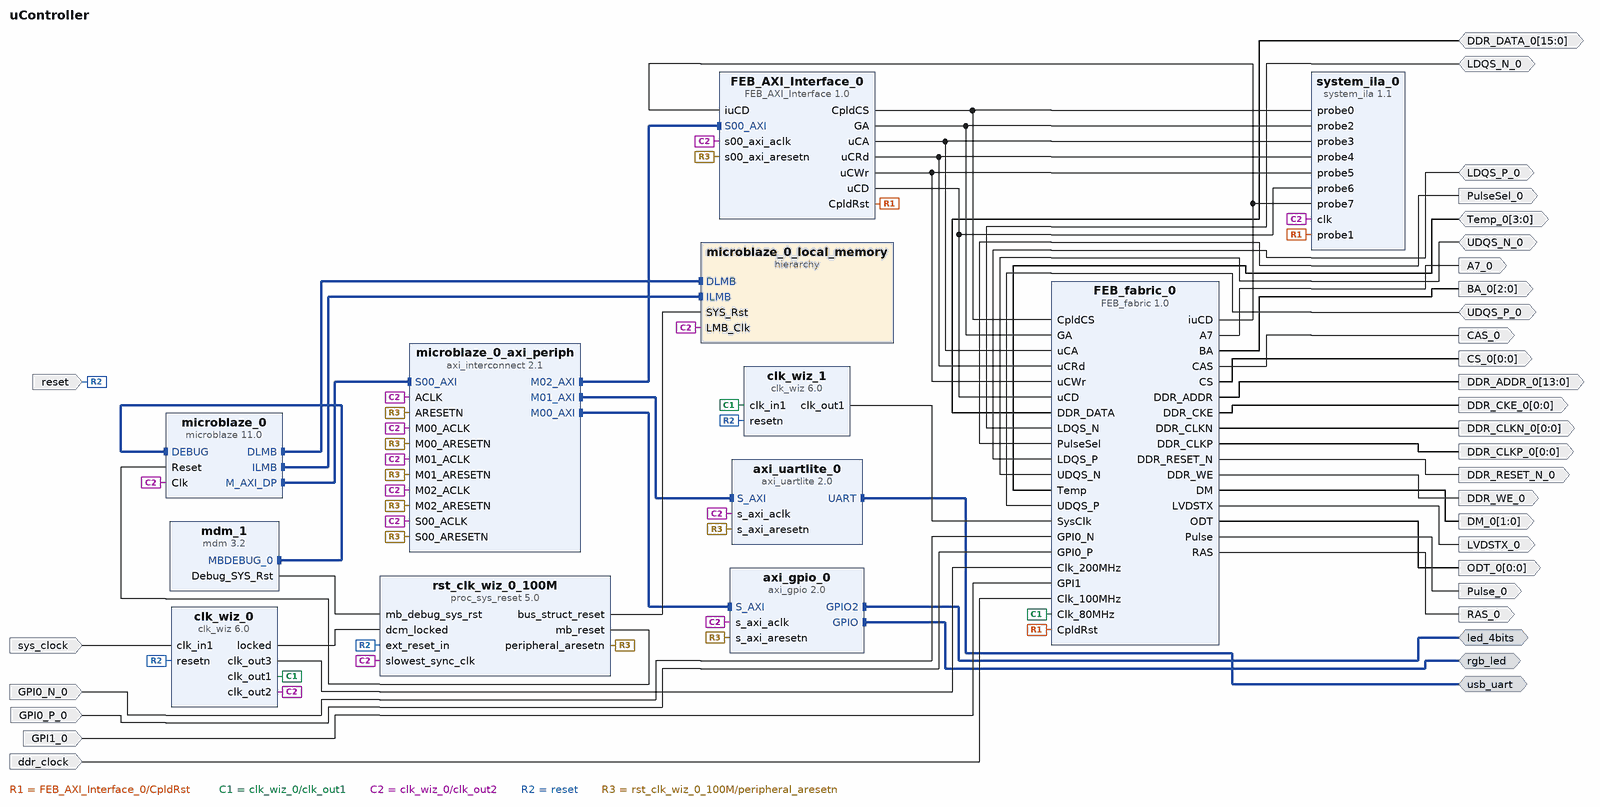
[diagram p0: block diagram of the top level]
# Vivado block design uController, xc7s50csga324-1, Vivado 2022.2
create_bd_design uController

create_bd_intf_port -mode Master -vlnv xilinx.com:interface:gpio_rtl:1.0 rgb_led
create_bd_intf_port -mode Master -vlnv xilinx.com:interface:gpio_rtl:1.0 led_4bits
create_bd_intf_port -mode Master -vlnv xilinx.com:interface:uart_rtl:1.0 usb_uart
create_bd_port -dir I -type clk sys_clock
set_property -dict {CONFIG.FREQ_HZ 12000000 CONFIG.PHASE 0.0} [get_bd_ports sys_clock]
create_bd_port -dir I -type rst reset
set_property -dict {CONFIG.POLARITY ACTIVE_LOW} [get_bd_ports reset]
create_bd_port -dir O -from 2 -to 0 BA_0
create_bd_port -dir O CAS_0
create_bd_port -dir O -from 0 -to 0 CS_0
create_bd_port -dir O -from 13 -to 0 DDR_ADDR_0
create_bd_port -dir O -from 0 -to 0 DDR_CKE_0
create_bd_port -dir O -from 0 -to 0 DDR_CLKN_0
create_bd_port -dir O -from 0 -to 0 DDR_CLKP_0
create_bd_port -dir IO -from 15 -to 0 DDR_DATA_0
create_bd_port -dir O DDR_RESET_N_0
create_bd_port -dir O DDR_WE_0
create_bd_port -dir O -from 1 -to 0 DM_0
create_bd_port -dir IO LDQS_N_0
create_bd_port -dir IO LDQS_P_0
create_bd_port -dir O -from 0 -to 0 ODT_0
create_bd_port -dir O RAS_0
create_bd_port -dir IO UDQS_N_0
create_bd_port -dir IO UDQS_P_0
create_bd_port -dir I -type clk ddr_clock
set_property -dict {CONFIG.FREQ_HZ 100000000 CONFIG.PHASE 0.0} [get_bd_ports ddr_clock]
create_bd_port -dir O PulseSel_0
create_bd_port -dir O Pulse_0
create_bd_port -dir I GPI1_0
create_bd_port -dir I GPI0_P_0
create_bd_port -dir I GPI0_N_0
create_bd_port -dir O A7_0
create_bd_port -dir O LVDSTX_0
create_bd_port -dir IO -from 3 -to 0 Temp_0

create_bd_cell -type ip -vlnv xilinx.com:ip:microblaze:11.0 microblaze_0
set_property -dict [list \
  CONFIG.C_DEBUG_ENABLED 1 \
  CONFIG.C_D_AXI 1 \
  CONFIG.C_D_LMB 1 \
  CONFIG.C_I_LMB 1 \
  CONFIG.G_TEMPLATE_LIST 8 \
] [get_bd_cells microblaze_0]
create_bd_cell -type ip -vlnv xilinx.com:ip:clk_wiz:6.0 clk_wiz_0
set_property -dict [list \
  CONFIG.CLKOUT1_JITTER 588.050 \
  CONFIG.CLKOUT1_PHASE_ERROR 613.025 \
  CONFIG.CLKOUT1_REQUESTED_OUT_FREQ 80.000 \
  CONFIG.CLKOUT2_JITTER 571.161 \
  CONFIG.CLKOUT2_PHASE_ERROR 613.025 \
  CONFIG.CLKOUT2_REQUESTED_OUT_FREQ 100.000 \
  CONFIG.CLKOUT2_USED true \
  CONFIG.CLKOUT3_JITTER 522.440 \
  CONFIG.CLKOUT3_PHASE_ERROR 613.025 \
  CONFIG.CLKOUT3_REQUESTED_OUT_FREQ 200.000 \
  CONFIG.CLKOUT3_USED true \
  CONFIG.CLKOUT4_JITTER 571.161 \
  CONFIG.CLKOUT4_PHASE_ERROR 613.025 \
  CONFIG.CLKOUT4_REQUESTED_OUT_FREQ 100.000 \
  CONFIG.CLKOUT4_USED false \
  CONFIG.CLK_IN1_BOARD_INTERFACE sys_clock \
  CONFIG.CLK_IN2_BOARD_INTERFACE Custom \
  CONFIG.MMCM_CLKFBOUT_MULT_F 50.000 \
  CONFIG.MMCM_CLKIN2_PERIOD 10.000 \
  CONFIG.MMCM_CLKOUT0_DIVIDE_F 7.500 \
  CONFIG.MMCM_CLKOUT1_DIVIDE 6 \
  CONFIG.MMCM_CLKOUT2_DIVIDE 3 \
  CONFIG.MMCM_CLKOUT3_DIVIDE 1 \
  CONFIG.NUM_OUT_CLKS 3 \
  CONFIG.RESET_BOARD_INTERFACE reset \
  CONFIG.RESET_PORT resetn \
  CONFIG.RESET_TYPE ACTIVE_LOW \
  CONFIG.SECONDARY_SOURCE Single_ended_clock_capable_pin \
  CONFIG.USE_BOARD_FLOW true \
  CONFIG.USE_INCLK_SWITCHOVER false \
] [get_bd_cells clk_wiz_0]
create_bd_cell -type ip -vlnv xilinx.com:ip:axi_gpio:2.0 axi_gpio_0
set_property -dict [list \
  CONFIG.GPIO2_BOARD_INTERFACE led_4bits \
  CONFIG.GPIO_BOARD_INTERFACE rgb_led \
  CONFIG.USE_BOARD_FLOW true \
] [get_bd_cells axi_gpio_0]
create_bd_cell -type ip -vlnv xilinx.com:ip:axi_uartlite:2.0 axi_uartlite_0
set_property -dict [list \
  CONFIG.C_BAUDRATE 230400 \
  CONFIG.UARTLITE_BOARD_INTERFACE usb_uart \
  CONFIG.USE_BOARD_FLOW true \
] [get_bd_cells axi_uartlite_0]
create_bd_cell -type hier microblaze_0_local_memory
create_bd_cell -type ip -vlnv xilinx.com:ip:mdm:3.2 mdm_1
create_bd_cell -type ip -vlnv xilinx.com:ip:proc_sys_reset:5.0 rst_clk_wiz_0_100M
create_bd_cell -type ip -vlnv xilinx.com:ip:axi_interconnect:2.1 microblaze_0_axi_periph
set_property -dict {CONFIG.NUM_MI 3} [get_bd_cells microblaze_0_axi_periph]
create_bd_cell -type ip -vlnv xilinx.com:ip:clk_wiz:6.0 clk_wiz_1
set_property -dict [list \
  CONFIG.CLKIN1_JITTER_PS 125.0 \
  CONFIG.CLKOUT1_JITTER 124.571 \
  CONFIG.CLKOUT1_PHASE_ERROR 100.585 \
  CONFIG.CLKOUT1_REQUESTED_OUT_FREQ 160.000 \
  CONFIG.MMCM_CLKFBOUT_MULT_F 12.500 \
  CONFIG.MMCM_CLKIN1_PERIOD 12.500 \
  CONFIG.MMCM_CLKIN2_PERIOD 10.0 \
  CONFIG.MMCM_CLKOUT0_DIVIDE_F 6.250 \
  CONFIG.PRIM_IN_FREQ 80.000 \
  CONFIG.RESET_PORT resetn \
  CONFIG.RESET_TYPE ACTIVE_LOW \
  CONFIG.USE_LOCKED false \
] [get_bd_cells clk_wiz_1]
create_bd_cell -type ip -vlnv xilinx.com:ip:system_ila:1.1 system_ila_0
set_property -dict [list \
  CONFIG.C_MON_TYPE NATIVE \
  CONFIG.C_NUM_OF_PROBES 8 \
  CONFIG.C_PROBE0_TYPE 0 \
  CONFIG.C_PROBE1_TYPE 0 \
  CONFIG.C_PROBE2_TYPE 0 \
  CONFIG.C_PROBE3_TYPE 0 \
  CONFIG.C_PROBE4_TYPE 0 \
  CONFIG.C_PROBE5_TYPE 0 \
  CONFIG.C_PROBE6_TYPE 0 \
] [get_bd_cells system_ila_0]
create_bd_cell -type ip -vlnv fnal.gov:user:FEB_AXI_Interface:1.0 FEB_AXI_Interface_0
create_bd_cell -type ip -vlnv fnal.gov:user:FEB_fabric:1.0 FEB_fabric_0

# ---- hierarchy /microblaze_0_local_memory ----
current_bd_instance /microblaze_0_local_memory
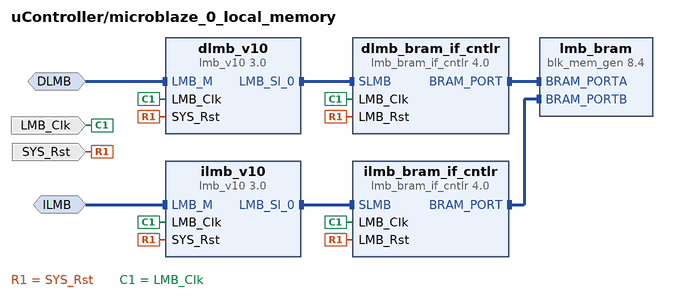
[diagram p1: block diagram inside /microblaze_0_local_memory]
create_bd_intf_pin -mode MirroredMaster -vlnv xilinx.com:interface:lmb_rtl:1.0 DLMB
create_bd_intf_pin -mode MirroredMaster -vlnv xilinx.com:interface:lmb_rtl:1.0 ILMB
create_bd_pin -dir I -type clk LMB_Clk
create_bd_pin -dir I -type rst SYS_Rst

create_bd_cell -type ip -vlnv xilinx.com:ip:lmb_v10:3.0 dlmb_v10
create_bd_cell -type ip -vlnv xilinx.com:ip:lmb_v10:3.0 ilmb_v10
create_bd_cell -type ip -vlnv xilinx.com:ip:lmb_bram_if_cntlr:4.0 dlmb_bram_if_cntlr
set_property -dict {CONFIG.C_ECC 0} [get_bd_cells dlmb_bram_if_cntlr]
create_bd_cell -type ip -vlnv xilinx.com:ip:lmb_bram_if_cntlr:4.0 ilmb_bram_if_cntlr
set_property -dict {CONFIG.C_ECC 0} [get_bd_cells ilmb_bram_if_cntlr]
create_bd_cell -type ip -vlnv xilinx.com:ip:blk_mem_gen:8.4 lmb_bram
set_property -dict {CONFIG.Memory_Type True_Dual_Port_RAM CONFIG.use_bram_block BRAM_Controller} [get_bd_cells lmb_bram]

# ---- connections ----

current_bd_instance /microblaze_0_local_memory
connect_bd_intf_net -intf_net microblaze_0_dlmb [get_bd_intf_pins DLMB] [get_bd_intf_pins dlmb_v10/LMB_M]
connect_bd_intf_net -intf_net microblaze_0_dlmb_bus [get_bd_intf_pins dlmb_v10/LMB_Sl_0] [get_bd_intf_pins dlmb_bram_if_cntlr/SLMB]
connect_bd_intf_net -intf_net microblaze_0_dlmb_cntlr [get_bd_intf_pins dlmb_bram_if_cntlr/BRAM_PORT] [get_bd_intf_pins lmb_bram/BRAM_PORTA]
connect_bd_intf_net -intf_net microblaze_0_ilmb [get_bd_intf_pins ILMB] [get_bd_intf_pins ilmb_v10/LMB_M]
connect_bd_intf_net -intf_net microblaze_0_ilmb_bus [get_bd_intf_pins ilmb_v10/LMB_Sl_0] [get_bd_intf_pins ilmb_bram_if_cntlr/SLMB]
connect_bd_intf_net -intf_net microblaze_0_ilmb_cntlr [get_bd_intf_pins ilmb_bram_if_cntlr/BRAM_PORT] [get_bd_intf_pins lmb_bram/BRAM_PORTB]
connect_bd_net [get_bd_pins SYS_Rst] \
  [get_bd_pins dlmb_v10/SYS_Rst] [get_bd_pins dlmb_bram_if_cntlr/LMB_Rst] [get_bd_pins ilmb_v10/SYS_Rst] \
  [get_bd_pins ilmb_bram_if_cntlr/LMB_Rst]
connect_bd_net -net microblaze_0_Clk [get_bd_pins LMB_Clk] \
  [get_bd_pins dlmb_v10/LMB_Clk] [get_bd_pins dlmb_bram_if_cntlr/LMB_Clk] [get_bd_pins ilmb_v10/LMB_Clk] \
  [get_bd_pins ilmb_bram_if_cntlr/LMB_Clk]
set_property HDL_ATTRIBUTE.BMM_INFO_ADDRESS_SPACE {byte  0x00000000 32 > uController microblaze_0_local_memory/lmb_bram} [get_bd_cells dlmb_bram_if_cntlr]
set_property HDL_ATTRIBUTE.KEEP_HIERARCHY yes [get_bd_cells dlmb_bram_if_cntlr]

current_bd_instance /
connect_bd_intf_net [get_bd_intf_ports rgb_led] [get_bd_intf_pins axi_gpio_0/GPIO]
connect_bd_intf_net [get_bd_intf_ports led_4bits] [get_bd_intf_pins axi_gpio_0/GPIO2]
connect_bd_intf_net [get_bd_intf_ports usb_uart] [get_bd_intf_pins axi_uartlite_0/UART]
connect_bd_intf_net [get_bd_intf_pins microblaze_0/M_AXI_DP] [get_bd_intf_pins microblaze_0_axi_periph/S00_AXI]
connect_bd_intf_net [get_bd_intf_pins microblaze_0_axi_periph/M00_AXI] [get_bd_intf_pins axi_gpio_0/S_AXI]
connect_bd_intf_net [get_bd_intf_pins microblaze_0_axi_periph/M01_AXI] [get_bd_intf_pins axi_uartlite_0/S_AXI]
connect_bd_intf_net [get_bd_intf_pins microblaze_0_axi_periph/M02_AXI] [get_bd_intf_pins FEB_AXI_Interface_0/S00_AXI]
connect_bd_intf_net [get_bd_intf_pins mdm_1/MBDEBUG_0] [get_bd_intf_pins microblaze_0/DEBUG]
connect_bd_intf_net [get_bd_intf_pins microblaze_0/DLMB] [get_bd_intf_pins microblaze_0_local_memory/DLMB]
connect_bd_intf_net [get_bd_intf_pins microblaze_0/ILMB] [get_bd_intf_pins microblaze_0_local_memory/ILMB]
connect_bd_net -net FEB_AXI_Interface_0_CpldCS [get_bd_pins FEB_AXI_Interface_0/CpldCS] \
  [get_bd_pins system_ila_0/probe0] [get_bd_pins FEB_fabric_0/CpldCS]
connect_bd_net -net FEB_AXI_Interface_0_CpldRst [get_bd_pins FEB_AXI_Interface_0/CpldRst] \
  [get_bd_pins system_ila_0/probe1] [get_bd_pins FEB_fabric_0/CpldRst]
connect_bd_net -net FEB_AXI_Interface_0_GA [get_bd_pins FEB_AXI_Interface_0/GA] [get_bd_pins system_ila_0/probe2] [get_bd_pins FEB_fabric_0/GA]
connect_bd_net -net FEB_AXI_Interface_0_uCA [get_bd_pins FEB_AXI_Interface_0/uCA] [get_bd_pins system_ila_0/probe3] [get_bd_pins FEB_fabric_0/uCA]
connect_bd_net -net FEB_AXI_Interface_0_uCRd [get_bd_pins FEB_AXI_Interface_0/uCRd] [get_bd_pins system_ila_0/probe4] [get_bd_pins FEB_fabric_0/uCRd]
connect_bd_net -net FEB_AXI_Interface_0_uCWr [get_bd_pins FEB_AXI_Interface_0/uCWr] [get_bd_pins system_ila_0/probe5] [get_bd_pins FEB_fabric_0/uCWr]
connect_bd_net [get_bd_pins FEB_fabric_0/A7] [get_bd_ports A7_0]
connect_bd_net [get_bd_pins FEB_fabric_0/BA] [get_bd_ports BA_0]
connect_bd_net [get_bd_pins FEB_fabric_0/CAS] [get_bd_ports CAS_0]
connect_bd_net [get_bd_pins FEB_fabric_0/CS] [get_bd_ports CS_0]
connect_bd_net [get_bd_pins FEB_fabric_0/DDR_ADDR] [get_bd_ports DDR_ADDR_0]
connect_bd_net [get_bd_pins FEB_fabric_0/DDR_CKE] [get_bd_ports DDR_CKE_0]
connect_bd_net [get_bd_pins FEB_fabric_0/DDR_CLKN] [get_bd_ports DDR_CLKN_0]
connect_bd_net [get_bd_pins FEB_fabric_0/DDR_CLKP] [get_bd_ports DDR_CLKP_0]
connect_bd_net [get_bd_pins FEB_fabric_0/DDR_RESET_N] [get_bd_ports DDR_RESET_N_0]
connect_bd_net [get_bd_pins FEB_fabric_0/DDR_WE] [get_bd_ports DDR_WE_0]
connect_bd_net [get_bd_pins FEB_fabric_0/DM] [get_bd_ports DM_0]
connect_bd_net [get_bd_pins FEB_fabric_0/LVDSTX] [get_bd_ports LVDSTX_0]
connect_bd_net [get_bd_pins FEB_fabric_0/ODT] [get_bd_ports ODT_0]
connect_bd_net [get_bd_pins FEB_fabric_0/Pulse] [get_bd_ports Pulse_0]
connect_bd_net -net FEB_fabric_0_PulseSel [get_bd_ports PulseSel_0] [get_bd_pins FEB_fabric_0/PulseSel]
connect_bd_net [get_bd_pins FEB_fabric_0/RAS] [get_bd_ports RAS_0]
connect_bd_net -net FEB_fabric_0_iuCD [get_bd_pins FEB_fabric_0/iuCD] [get_bd_pins FEB_AXI_Interface_0/iuCD] [get_bd_pins system_ila_0/probe7]
connect_bd_net -net GPI0_N_0_1 [get_bd_ports GPI0_N_0] [get_bd_pins FEB_fabric_0/GPI0_N]
connect_bd_net -net GPI0_P_0_1 [get_bd_ports GPI0_P_0] [get_bd_pins FEB_fabric_0/GPI0_P]
connect_bd_net -net GPI1_0_1 [get_bd_ports GPI1_0] [get_bd_pins FEB_fabric_0/GPI1]
connect_bd_net -net Net [get_bd_pins FEB_AXI_Interface_0/uCD] [get_bd_pins system_ila_0/probe6] [get_bd_pins FEB_fabric_0/uCD]
connect_bd_net [get_bd_ports DDR_DATA_0] [get_bd_pins FEB_fabric_0/DDR_DATA]
connect_bd_net [get_bd_ports LDQS_N_0] [get_bd_pins FEB_fabric_0/LDQS_N]
connect_bd_net [get_bd_ports LDQS_P_0] [get_bd_pins FEB_fabric_0/LDQS_P]
connect_bd_net [get_bd_ports UDQS_N_0] [get_bd_pins FEB_fabric_0/UDQS_N]
connect_bd_net [get_bd_ports UDQS_P_0] [get_bd_pins FEB_fabric_0/UDQS_P]
connect_bd_net [get_bd_ports Temp_0] [get_bd_pins FEB_fabric_0/Temp]
connect_bd_net [get_bd_pins clk_wiz_0/clk_out1] [get_bd_pins clk_wiz_1/clk_in1] [get_bd_pins FEB_fabric_0/Clk_80MHz]
connect_bd_net [get_bd_pins clk_wiz_0/clk_out2] \
  [get_bd_pins rst_clk_wiz_0_100M/slowest_sync_clk] [get_bd_pins microblaze_0/Clk] [get_bd_pins microblaze_0_axi_periph/ACLK] \
  [get_bd_pins microblaze_0_axi_periph/S00_ACLK] [get_bd_pins microblaze_0_axi_periph/M00_ACLK] \
  [get_bd_pins microblaze_0_axi_periph/M01_ACLK] [get_bd_pins microblaze_0_axi_periph/M02_ACLK] \
  [get_bd_pins axi_uartlite_0/s_axi_aclk] [get_bd_pins axi_gpio_0/s_axi_aclk] [get_bd_pins microblaze_0_local_memory/LMB_Clk] \
  [get_bd_pins system_ila_0/clk] [get_bd_pins FEB_AXI_Interface_0/s00_axi_aclk]
connect_bd_net [get_bd_pins clk_wiz_0/clk_out3] [get_bd_pins FEB_fabric_0/Clk_200MHz]
connect_bd_net [get_bd_pins clk_wiz_0/locked] [get_bd_pins rst_clk_wiz_0_100M/dcm_locked]
connect_bd_net [get_bd_pins clk_wiz_1/clk_out1] [get_bd_pins FEB_fabric_0/SysClk]
connect_bd_net [get_bd_ports ddr_clock] [get_bd_pins FEB_fabric_0/Clk_100MHz]
connect_bd_net [get_bd_pins mdm_1/Debug_SYS_Rst] [get_bd_pins rst_clk_wiz_0_100M/mb_debug_sys_rst]
connect_bd_net [get_bd_ports reset] [get_bd_pins clk_wiz_0/resetn] [get_bd_pins rst_clk_wiz_0_100M/ext_reset_in] [get_bd_pins clk_wiz_1/resetn]
connect_bd_net [get_bd_pins rst_clk_wiz_0_100M/bus_struct_reset] [get_bd_pins microblaze_0_local_memory/SYS_Rst]
connect_bd_net [get_bd_pins rst_clk_wiz_0_100M/mb_reset] [get_bd_pins microblaze_0/Reset]
connect_bd_net [get_bd_pins rst_clk_wiz_0_100M/peripheral_aresetn] \
  [get_bd_pins microblaze_0_axi_periph/S00_ARESETN] [get_bd_pins axi_gpio_0/s_axi_aresetn] \
  [get_bd_pins microblaze_0_axi_periph/M00_ARESETN] [get_bd_pins microblaze_0_axi_periph/ARESETN] \
  [get_bd_pins axi_uartlite_0/s_axi_aresetn] [get_bd_pins microblaze_0_axi_periph/M01_ARESETN] \
  [get_bd_pins microblaze_0_axi_periph/M02_ARESETN] [get_bd_pins FEB_AXI_Interface_0/s00_axi_aresetn]
connect_bd_net [get_bd_ports sys_clock] [get_bd_pins clk_wiz_0/clk_in1]
set_property HDL_ATTRIBUTE.BMM_INFO_PROCESSOR {microblaze-le > uController microblaze_0_local_memory/dlmb_bram_if_cntlr} [get_bd_cells microblaze_0]
set_property HDL_ATTRIBUTE.KEEP_HIERARCHY yes [get_bd_cells microblaze_0]
set_property HDL_ATTRIBUTE.DEBUG true [get_bd_nets FEB_AXI_Interface_0_CpldCS]
set_property HDL_ATTRIBUTE.MARK_DEBUG true [get_bd_nets FEB_AXI_Interface_0_CpldCS]
set_property HDL_ATTRIBUTE.DEBUG true [get_bd_nets FEB_AXI_Interface_0_CpldRst]
set_property HDL_ATTRIBUTE.MARK_DEBUG true [get_bd_nets FEB_AXI_Interface_0_CpldRst]
set_property HDL_ATTRIBUTE.DEBUG true [get_bd_nets FEB_AXI_Interface_0_GA]
set_property HDL_ATTRIBUTE.MARK_DEBUG true [get_bd_nets FEB_AXI_Interface_0_GA]
set_property HDL_ATTRIBUTE.DEBUG true [get_bd_nets FEB_AXI_Interface_0_uCA]
set_property HDL_ATTRIBUTE.MARK_DEBUG true [get_bd_nets FEB_AXI_Interface_0_uCA]
set_property HDL_ATTRIBUTE.DEBUG true [get_bd_nets FEB_AXI_Interface_0_uCRd]
set_property HDL_ATTRIBUTE.MARK_DEBUG true [get_bd_nets FEB_AXI_Interface_0_uCRd]
set_property HDL_ATTRIBUTE.DEBUG true [get_bd_nets FEB_AXI_Interface_0_uCWr]
set_property HDL_ATTRIBUTE.MARK_DEBUG true [get_bd_nets FEB_AXI_Interface_0_uCWr]
set_property HDL_ATTRIBUTE.DEBUG true [get_bd_nets FEB_fabric_0_iuCD]
set_property HDL_ATTRIBUTE.MARK_DEBUG true [get_bd_nets FEB_fabric_0_iuCD]
set_property HDL_ATTRIBUTE.DEBUG true [get_bd_nets Net]
set_property HDL_ATTRIBUTE.MARK_DEBUG true [get_bd_nets Net]

# ---- address map ----
assign_bd_address -offset 0x00000000 -range 32K -target_address_space [get_bd_addr_spaces microblaze_0/Data] [get_bd_addr_segs microblaze_0_local_memory/dlmb_bram_if_cntlr/SLMB/Mem]
assign_bd_address -offset 0x40000000 -range 64K -target_address_space [get_bd_addr_spaces microblaze_0/Data] [get_bd_addr_segs axi_gpio_0/S_AXI/Reg]
assign_bd_address -offset 0x40600000 -range 64K -target_address_space [get_bd_addr_spaces microblaze_0/Data] [get_bd_addr_segs axi_uartlite_0/S_AXI/Reg]
assign_bd_address -offset 0x44A00000 -range 64K -target_address_space [get_bd_addr_spaces microblaze_0/Data] [get_bd_addr_segs FEB_AXI_Interface_0/S00_AXI/S00_AXI_reg]
assign_bd_address -offset 0x00000000 -range 32K -target_address_space [get_bd_addr_spaces microblaze_0/Instruction] [get_bd_addr_segs microblaze_0_local_memory/ilmb_bram_if_cntlr/SLMB/Mem]

validate_bd_design
save_bd_design
